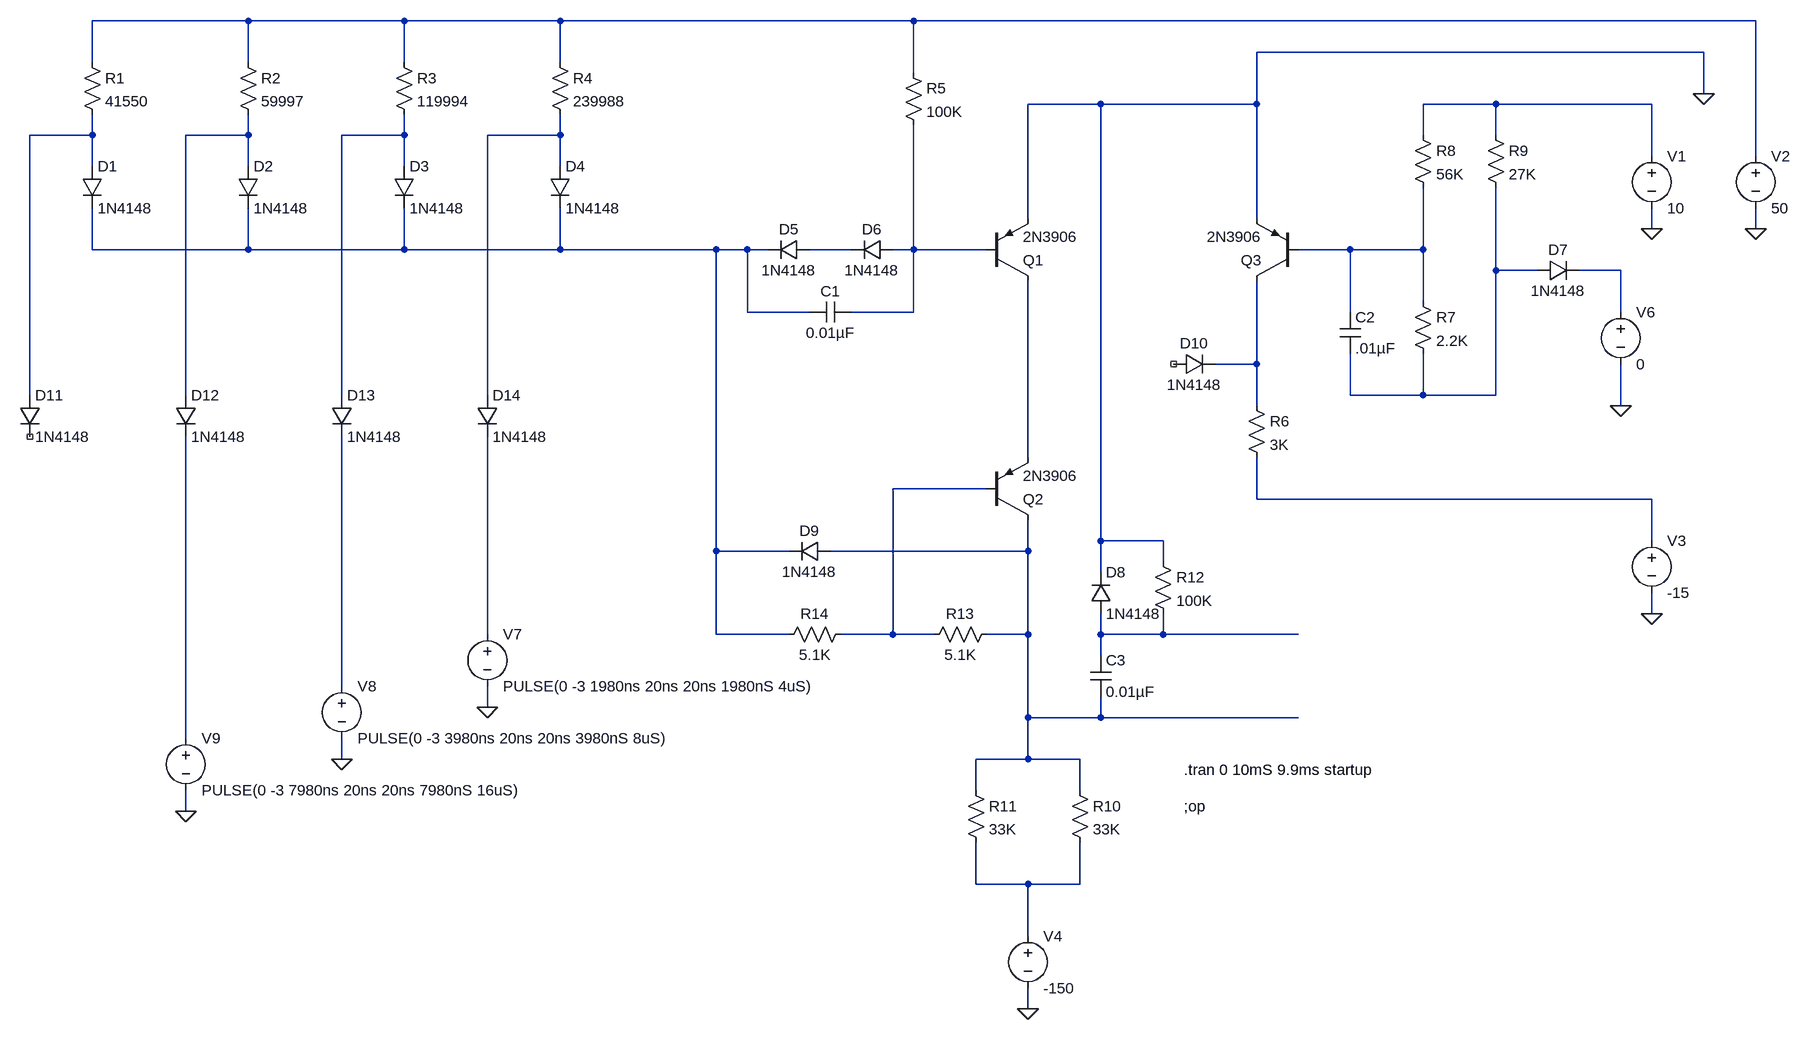
[diagram p0: schematic intensifier1.asc]
intensifier1.asc, the LTspice schematic file:
Version 4
SHEET 1 2456 1780
WIRE 80 48 -160 48
WIRE 320 48 80 48
WIRE 560 48 320 48
WIRE 1104 48 560 48
WIRE 2400 48 1104 48
WIRE 2320 96 1632 96
WIRE -160 112 -160 48
WIRE 80 112 80 48
WIRE 320 112 320 48
WIRE 560 112 560 48
WIRE 1104 128 1104 48
WIRE 2320 160 2320 96
WIRE 1392 176 1280 176
WIRE 1632 176 1632 96
WIRE 1632 176 1392 176
WIRE 2000 176 1888 176
WIRE 2240 176 2000 176
WIRE -160 224 -160 192
WIRE -160 224 -256 224
WIRE 80 224 80 192
WIRE 80 224 -16 224
WIRE 320 224 320 192
WIRE 320 224 224 224
WIRE 560 224 560 192
WIRE 560 224 448 224
WIRE 1888 224 1888 176
WIRE 2000 224 2000 176
WIRE 2240 256 2240 176
WIRE 2400 256 2400 48
WIRE -160 272 -160 224
WIRE 80 272 80 224
WIRE 320 272 320 224
WIRE 560 272 560 224
WIRE 1280 352 1280 176
WIRE 1632 352 1632 176
WIRE 2240 368 2240 336
WIRE 2400 368 2400 336
WIRE -160 400 -160 336
WIRE 80 400 80 336
WIRE 80 400 -160 400
WIRE 320 400 320 336
WIRE 320 400 80 400
WIRE 560 400 560 336
WIRE 560 400 320 400
WIRE 800 400 560 400
WIRE 848 400 800 400
WIRE 880 400 848 400
WIRE 1008 400 944 400
WIRE 1104 400 1104 208
WIRE 1104 400 1072 400
WIRE 1216 400 1104 400
WIRE 1776 400 1696 400
WIRE 1888 400 1888 304
WIRE 1888 400 1776 400
WIRE 2000 432 2000 304
WIRE 2064 432 2000 432
WIRE 2192 432 2128 432
WIRE 1888 480 1888 400
WIRE 848 496 848 400
WIRE 944 496 848 496
WIRE 1104 496 1104 400
WIRE 1104 496 1008 496
WIRE 1776 496 1776 400
WIRE 2192 496 2192 432
WIRE 1632 576 1632 448
WIRE 1632 576 1568 576
WIRE -256 624 -256 224
WIRE -16 624 -16 224
WIRE 224 624 224 224
WIRE 448 624 448 224
WIRE 1776 624 1776 560
WIRE 1888 624 1888 560
WIRE 1888 624 1776 624
WIRE 2000 624 2000 432
WIRE 2000 624 1888 624
WIRE 1632 640 1632 576
WIRE 2192 640 2192 576
WIRE 1280 720 1280 448
WIRE 1216 768 1072 768
WIRE 1632 784 1632 720
WIRE 2240 784 1632 784
WIRE 1392 848 1392 176
WIRE 1488 848 1392 848
WIRE 2240 848 2240 784
WIRE 800 864 800 400
WIRE 912 864 800 864
WIRE 1280 864 1280 816
WIRE 1280 864 976 864
WIRE 1488 880 1488 848
WIRE 1392 896 1392 848
WIRE 2240 960 2240 928
WIRE 448 992 448 688
WIRE 800 992 800 864
WIRE 912 992 800 992
WIRE 1072 992 1072 768
WIRE 1072 992 992 992
WIRE 1136 992 1072 992
WIRE 1280 992 1280 864
WIRE 1280 992 1216 992
WIRE 1392 992 1392 960
WIRE 1488 992 1488 960
WIRE 1488 992 1392 992
WIRE 1696 992 1488 992
WIRE 1392 1024 1392 992
WIRE 224 1072 224 688
WIRE 448 1104 448 1072
WIRE 1280 1120 1280 992
WIRE 1392 1120 1392 1088
WIRE 1392 1120 1280 1120
WIRE 1696 1120 1392 1120
WIRE -16 1152 -16 688
WIRE 224 1184 224 1152
WIRE 1280 1184 1280 1120
WIRE 1280 1184 1200 1184
WIRE 1360 1184 1280 1184
WIRE 1200 1232 1200 1184
WIRE 1360 1232 1360 1184
WIRE -16 1264 -16 1232
WIRE 1200 1376 1200 1312
WIRE 1280 1376 1200 1376
WIRE 1360 1376 1360 1312
WIRE 1360 1376 1280 1376
WIRE 1280 1456 1280 1376
WIRE 1280 1568 1280 1536
FLAG 1280 1568 0
FLAG 2240 960 0
FLAG 2240 368 0
FLAG 2400 368 0
FLAG 2320 160 0
FLAG 2192 640 0
FLAG 448 1104 0
FLAG 224 1184 0
FLAG -16 1264 0
SYMBOL res -176 96 R0
SYMATTR InstName R1
SYMATTR Value 41550
SYMBOL res 64 96 R0
SYMATTR InstName R2
SYMATTR Value 59997
SYMBOL res 304 96 R0
SYMATTR InstName R3
SYMATTR Value 119994
SYMBOL res 544 96 R0
SYMATTR InstName R4
SYMATTR Value 239988
SYMBOL diode -176 272 R0
SYMATTR InstName D1
SYMATTR Value 1N4148
SYMBOL diode 64 272 R0
SYMATTR InstName D2
SYMATTR Value 1N4148
SYMBOL diode 304 272 R0
SYMATTR InstName D3
SYMATTR Value 1N4148
SYMBOL diode 544 272 R0
SYMATTR InstName D4
SYMATTR Value 1N4148
SYMBOL diode 944 384 R90
WINDOW 0 0 32 VBottom 2
WINDOW 3 32 32 VTop 2
SYMATTR InstName D5
SYMATTR Value 1N4148
SYMBOL diode 1072 384 R90
WINDOW 0 0 32 VBottom 2
WINDOW 3 32 32 VTop 2
SYMATTR InstName D6
SYMATTR Value 1N4148
SYMBOL cap 1008 480 R90
WINDOW 0 0 32 VBottom 2
WINDOW 3 32 32 VTop 2
SYMATTR InstName C1
SYMATTR Value 0.01µF
SYMBOL res 1088 112 R0
SYMATTR InstName R5
SYMATTR Value 100K
SYMBOL pnp 1216 448 M180
SYMATTR InstName Q1
SYMATTR Value 2N3906
SYMBOL pnp 1216 816 M180
SYMATTR InstName Q2
SYMATTR Value 2N3906
SYMBOL pnp 1696 448 R180
SYMATTR InstName Q3
SYMATTR Value 2N3906
SYMBOL res 1616 624 R0
SYMATTR InstName R6
SYMATTR Value 3K
SYMBOL res 1872 464 R0
SYMATTR InstName R7
SYMATTR Value 2.2K
SYMBOL res 1872 208 R0
SYMATTR InstName R8
SYMATTR Value 56K
SYMBOL res 1984 208 R0
SYMATTR InstName R9
SYMATTR Value 27K
SYMBOL cap 1760 496 R0
SYMATTR InstName C2
SYMATTR Value .01µF
SYMBOL diode 2064 416 M90
WINDOW 0 0 32 VBottom 2
WINDOW 3 32 32 VTop 2
SYMATTR InstName D7
SYMATTR Value 1N4148
SYMBOL diode 1376 960 M180
WINDOW 0 24 64 Left 2
WINDOW 3 24 0 Left 2
SYMATTR InstName D8
SYMATTR Value 1N4148
SYMBOL diode 976 880 M270
WINDOW 0 32 32 VTop 2
WINDOW 3 0 32 VBottom 2
SYMATTR InstName D9
SYMATTR Value 1N4148
SYMBOL diode 1504 560 M90
WINDOW 0 0 32 VBottom 2
WINDOW 3 32 32 VTop 2
SYMATTR InstName D10
SYMATTR Value 1N4148
SYMBOL res 1344 1216 R0
SYMATTR InstName R10
SYMATTR Value 33K
SYMBOL res 1184 1216 R0
SYMATTR InstName R11
SYMATTR Value 33K
SYMBOL res 1472 864 R0
SYMATTR InstName R12
SYMATTR Value 100K
SYMBOL cap 1376 1024 R0
SYMATTR InstName C3
SYMATTR Value 0.01µF
SYMBOL res 1232 976 R90
WINDOW 0 0 56 VBottom 2
WINDOW 3 32 56 VTop 2
SYMATTR InstName R13
SYMATTR Value 5.1K
SYMBOL res 1008 976 R90
WINDOW 0 0 56 VBottom 2
WINDOW 3 32 56 VTop 2
SYMATTR InstName R14
SYMATTR Value 5.1K
SYMBOL voltage 2240 240 R0
WINDOW 123 0 0 Left 2
WINDOW 39 0 0 Left 2
SYMATTR InstName V1
SYMATTR Value 10
SYMBOL voltage 2400 240 R0
WINDOW 123 0 0 Left 2
WINDOW 39 0 0 Left 2
SYMATTR InstName V2
SYMATTR Value 50
SYMBOL voltage 2240 832 R0
WINDOW 123 0 0 Left 2
WINDOW 39 0 0 Left 2
SYMATTR InstName V3
SYMATTR Value -15
SYMBOL voltage 1280 1440 R0
WINDOW 123 0 0 Left 2
WINDOW 39 0 0 Left 2
SYMATTR InstName V4
SYMATTR Value -150
SYMBOL diode -272 624 R0
SYMATTR InstName D11
SYMATTR Value 1N4148
SYMBOL diode -32 624 R0
SYMATTR InstName D12
SYMATTR Value 1N4148
SYMBOL diode 208 624 R0
SYMATTR InstName D13
SYMATTR Value 1N4148
SYMBOL diode 432 624 R0
SYMATTR InstName D14
SYMATTR Value 1N4148
SYMBOL voltage 2192 480 R0
WINDOW 123 0 0 Left 2
WINDOW 39 0 0 Left 2
SYMATTR InstName V6
SYMATTR Value 0
SYMBOL voltage 448 976 R0
WINDOW 123 0 0 Left 2
WINDOW 39 0 0 Left 2
SYMATTR InstName V7
SYMATTR Value PULSE(0 -3 1980ns 20ns 20ns 1980nS 4uS)
SYMBOL voltage 224 1056 R0
WINDOW 123 0 0 Left 2
WINDOW 39 0 0 Left 2
SYMATTR InstName V8
SYMATTR Value PULSE(0 -3 3980ns 20ns 20ns 3980nS 8uS)
SYMBOL voltage -16 1136 R0
WINDOW 123 0 0 Left 2
WINDOW 39 0 0 Left 2
SYMATTR InstName V9
SYMATTR Value PULSE(0 -3 7980ns 20ns 20ns 7980nS 16uS)
TEXT 1520 1256 Left 2 !;op
TEXT 1520 1200 Left 2 !.tran 0 10mS 9.9ms startup

The netlist it stands for:
* intensifier1.asc
R1 N001 N003 41550
R2 N001 N004 59997
R3 N001 N005 119994
R4 N001 N006 239988
D1 N003 N007 1N4148
D2 N004 N007 1N4148
D3 N005 N007 1N4148
D4 N006 N007 1N4148
D5 N008 N007 1N4148
D6 N009 N008 1N4148
C1 N009 N007 0.01µF
R5 N001 N009 100K
Q1 N014 N009 0 0 2N3906
Q2 N017 N015 N014 0 2N3906
Q3 N013 N010 0 0 2N3906
R6 N013 N016 3K
R7 N010 N011 2.2K
R8 N002 N010 56K
R9 N002 N011 27K
C2 N010 N011 .01µF
D7 N011 N012 1N4148
D8 N019 0 1N4148
D9 N017 N007 1N4148
D10 NC_01 N013 1N4148
R10 N017 N022 33K
R11 N017 N022 33K
R12 0 N019 100K
C3 N019 N017 0.01µF
R13 N017 N015 5.1K
R14 N015 N007 5.1K
V1 N002 0 10
V2 N001 0 50
V3 N016 0 -15
V4 N022 0 -150
D11 N003 NC_02 1N4148
D12 N004 N021 1N4148
D13 N005 N020 1N4148
D14 N006 N018 1N4148
V6 N012 0 0
V7 N018 0 PULSE(0 -3 1980ns 20ns 20ns 1980nS 4uS)
V8 N020 0 PULSE(0 -3 3980ns 20ns 20ns 3980nS 8uS)
V9 N021 0 PULSE(0 -3 7980ns 20ns 20ns 7980nS 16uS)
.model D D
.lib standard.dio
.model NPN NPN
.model PNP PNP
.lib standard.bjt
;op
.tran 0 10mS 9.9ms startup
.backanno
.end